# Altium project PCB_VIP_mobile_device.PrjPcb (part 1 of 2)
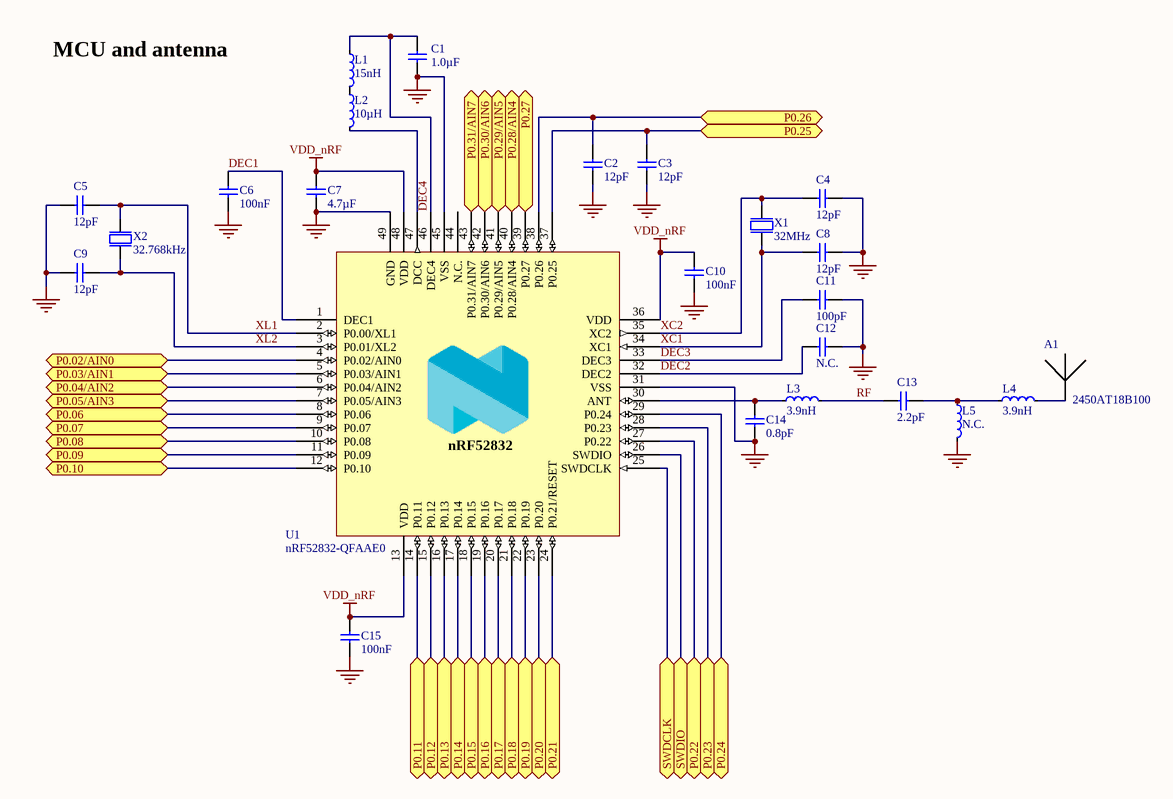
[diagram p0: Mobile_device_sheet2_mcu.SchDoc]
5 sheets, 103 parts. Net scope: flat (ports and power ports of the same name join across sheets).
Board file: Mobile_device.PcbDoc
Sheets:
  Mobile_device_sheet2_mcu.SchDoc
  Mobile_device_sheet3_pin_map.SchDoc
  Mobile_device_sheet4_sensor.SchDoc
  Mobile_device_sheet5_power_supply.SchDoc
  Mobile_device_sheet6_interfaces.SchDoc

## Sheet Mobile_device_sheet2_mcu.SchDoc
size A4; SheetNumber: 1; SheetTotal: 5

### Parts
A1  2450AT18B100  [2450AT18B100]
C1  1.0µF  [CAPC1608X06L]
C2  12pF  [CAPC1005X04L]
C3  12pF  [CAPC1005X04L]
C4  12pF  [CAPC1005X04L]
C5  12pF  [CAPC1005X04L]
C6  100nF  [CAPC1005X04L]
C7  4.7µF  [CAPC1608X06L]
C8  12pF  [CAPC1005X04L]
C9  12pF  [CAPC1005X04L]
C10  100nF  [CAPC1005X04L]
C11  100pF  [CAPC1005X04L]
C12  N.C.  [CAPC1005X04L]
C13  2.2pF  [CAPC1005X04L]
C14  0.8pF  [CAPC1005X04L]
C15  100nF  [CAPC1005X04L]
L1  15nH  [INDC1005X04L]
L2  10µH  [INDC1608X06L]
L3  3.9nH  [INDC1005X04L]
L4  3.9nH  [INDC1005X04L]
L5  N.C.  [INDC1005X04L]
U1  nRF52832-QFAAE0  [QFN40P600X600X90-48N]
X1  32MHz  [BT-XTAL_2016]
X2  32.768kHz  [XTAL_2012]

### Ports
P0.02/AIN0 (bidir), P0.03/AIN1 (bidir), P0.04/AIN2 (bidir), P0.05/AIN3 (bidir), P0.06 (bidir), P0.07 (bidir), P0.08 (bidir), P0.09 (bidir), P0.10 (bidir), P0.11 (bidir), P0.12 (bidir), P0.13 (bidir), P0.14 (bidir), P0.15 (bidir), P0.16 (bidir), P0.17 (bidir), P0.18 (bidir), P0.19 (bidir), P0.20 (bidir), P0.21 (bidir), P0.22 (bidir), P0.23 (bidir), P0.24 (bidir), P0.25 (bidir), P0.26 (bidir), P0.27 (bidir), P0.28/AIN4 (bidir), P0.29/AIN5 (bidir), P0.30/AIN6 (bidir), P0.31/AIN7 (bidir), SWDCLK (bidir), SWDIO (bidir)

### Nets
GND: C1.1 C2.1 C3.1 C4.2 C5.2 C6.2 C7.2 C8.2 C9.2 C10.2 C11.2 C12.1 C14.1 C15.2 L5.2 U1.31(VSS) U1.45(VSS) U1.49(GND) X1.2(GND) X1.4(GND)
VDD_nRF: C7.1 C10.1 C15.1 U1.13(VDD) U1.36(VDD) U1.48(VDD)
DEC1: C6.1 U1.1(DEC1)
DEC2: C12.2 U1.32(DEC2)
DEC3: C11.1 U1.33(DEC3)
DEC4: C1.2 L1.1 U1.46(DEC4)
P0.02: U1.4(P0.02/AIN0) ; port P0.02/AIN0
P0.03: U1.5(P0.03/AIN1) ; port P0.03/AIN1
P0.04: U1.6(P0.04/AIN2) ; port P0.04/AIN2
P0.05: U1.7(P0.05/AIN3) ; port P0.05/AIN3
P0.06: U1.8(P0.06) ; port P0.06
P0.07: U1.9(P0.07) ; port P0.07
P0.08: U1.10(P0.08) ; port P0.08
P0.09: U1.11(P0.09) ; port P0.09
P0.10: U1.12(P0.10) ; port P0.10
P0.11: U1.14(P0.11) ; port P0.11
P0.12: U1.15(P0.12) ; port P0.12
P0.13: U1.16(P0.13) ; port P0.13
P0.14: U1.17(P0.14) ; port P0.14
P0.15: U1.18(P0.15) ; port P0.15
P0.16: U1.19(P0.16) ; port P0.16
P0.17: U1.20(P0.17) ; port P0.17
P0.18: U1.21(P0.18) ; port P0.18
P0.19: U1.22(P0.19) ; port P0.19
P0.20: U1.23(P0.20) ; port P0.20
P0.21: U1.24(P0.21/RESET) ; port P0.21
P0.22: U1.27(P0.22) ; port P0.22
P0.23: U1.28(P0.23) ; port P0.23
P0.24: U1.29(P0.24) ; port P0.24
P0.25: C3.2 U1.37(P0.25) ; port P0.25
P0.26: C2.2 U1.38(P0.26) ; port P0.26
P0.27: U1.39(P0.27) ; port P0.27
P0.28: U1.40(P0.28/AIN4) ; port P0.28/AIN4
P0.29: U1.41(P0.29/AIN5) ; port P0.29/AIN5
P0.30: U1.42(P0.30/AIN6) ; port P0.30/AIN6
P0.31: U1.43(P0.31/AIN7) ; port P0.31/AIN7
RF: C13.2 L3.2
XC1: C8.1 U1.34(XC1) X1.1(inp)
XC2: C4.1 U1.35(XC2) X1.3(out)
XL1: C5.1 U1.2(P0.00/XL1) X2.1(inp)
XL2: C9.1 U1.3(P0.01/XL2) X2.2(out)
NetA1_1: A1.1 L4.2
NetC13_1: C13.1 L4.1 L5.1
NetC14_2: C14.2 L3.1 U1.30(ANT)
NetL1_2: L1.2 L2.1
NetL2_2: L2.2 U1.47(DCC)
NetP5_2: U1.26(SWDIO) ; port SWDIO
NetP5_4: U1.25(SWDCLK) ; port SWDCLK

Not connected (* = marked no-connect by the designer): U1 44(N.C.)

### Notes on the sheet
- MCU and antenna
- (in symbol nRF52832-QFAAE0) nRF52832

### Library data of the parts
A1 = Johanson 2450AT18B100: 2.45 GHz chip antenna; Manufacturer: Johanson Technology; Part number IPS: 00000007781; Artikkelnr Noca: N.A.; Part Number: Johanson 2450AT18B100; Manufacturer Part Number: 2450AT18B100; Footprint Doc: 2450AT18B100; LatestRevisionDate: 2013-09-13; Pin Count: 2; Publisher: Nordic Semiconductor; Published: 2013-09-13; Value: 2450AT18B100; Note: *; ComponentLink1URL: *; ComponentLink1Description: Datasheet; ComponentLink2URL: *; ComponentLink2Description: Supplier link; HelpURL: http://www.johansontechnology.com/datasheets/antennas/2450AT18B100.pdf; Supplier 1: Digi-Key; Supplier Part Number 1: 712-1006-1-ND; Supplier 2: *; Supplier Part Number 2: *
C1 = C0603-1µ0: Capacitor, X7R, ±10%; Part number IPS: 00000000616; Note: 16V; Artikkelnr Noca: 20039282; Part Number: C0603-1µ0; Manufacturer: *; Manufacturer Part Number: *; LatestRevisionDate: 2013-06-05; Pin Count: 2; Publisher: Nordic Semiconductor; Published: 2009-05-08; Value: 1.0µF; Footprint Doc: 0603; ComponentLink1URL: *; ComponentLink1Description: Datasheet; ComponentLink2URL: *; ComponentLink2Description: Supplier link; HelpURL: *; Supplier 1: *; Supplier Part Number 1: *; Supplier 2: *; Supplier Part Number 2: *
C2-C5 C8 C9 = C0402-12p: Capacitor, NP0, ±2%; Part number IPS: 00000002398; Note: 50V; Artikkelnr Noca: 20029159; Part Number: C0402-12p; Manufacturer: *; Manufacturer Part Number: *; LatestRevisionDate: 2011-05-11; Pin Count: 2; Publisher: Nordic Semiconductor; Published: 2009-05-08; Value: 12pF; Footprint Doc: 0402; ComponentLink1URL: *; ComponentLink1Description: Datasheet; ComponentLink2URL: *; ComponentLink2Description: Supplier link; HelpURL: *; Supplier 1: *; Supplier Part Number 1: *; Supplier 2: *; Supplier Part Number 2: *
C6 C10 C15 = C0402-100n: Capacitor, X7R, ±10%; Part number IPS: 00000005296; Note: 16V; Artikkelnr Noca: 20039200; Part Number: C0402-100n; Manufacturer: *; Manufacturer Part Number: *; LatestRevisionDate: 2009-11-23; Pin Count: 2; Publisher: Nordic Semiconductor; Published: 2009-05-08; Value: 100nF; Footprint Doc: 0402; ComponentLink1URL: *; ComponentLink1Description: Datasheet; ComponentLink2URL: *; ComponentLink2Description: Supplier link; HelpURL: *; Supplier 1: *; Supplier Part Number 1: *; Supplier 2: *; Supplier Part Number 2: *
C7 = C0603-4µ7: Capacitor, X5R, ±10%; Part number IPS: 00000007783; Note: 6.3V; Artikkelnr Noca: 20069060; Part Number: C0603-4µ7; Manufacturer: *; Manufacturer Part Number: *; LatestRevisionDate: 2009-11-23; Pin Count: 2; Publisher: Nordic Semiconductor; Published: 2009-05-08; Value: 4.7µF; Footprint Doc: 0603; ComponentLink1URL: *; ComponentLink1Description: Datasheet; ComponentLink2URL: *; ComponentLink2Description: Supplier link; HelpURL: *; Supplier 1: *; Supplier Part Number 1: *; Supplier 2: *; Supplier Part Number 2: *
C11 = C0402-100p: Capacitor, NP0, ±5%; Part number IPS: 00000002361; Note: 50V; Artikkelnr Noca: 20029135; Part Number: C0402-100p; Manufacturer: *; Manufacturer Part Number: *; LatestRevisionDate: 2009-05-08; Pin Count: 2; Publisher: Nordic Semiconductor; Published: 2009-05-08; Value: 100pF; Footprint Doc: 0402; ComponentLink1URL: *; ComponentLink1Description: Datasheet; ComponentLink2URL: *; ComponentLink2Description: Supplier link; HelpURL: *; Supplier 1: *; Supplier Part Number 1: *; Supplier 2: *; Supplier Part Number 2: *
C12 = C0402-N.C.: Not mounted; Note: Chip Cap; Artikkelnr Noca: N.A.; Assembly: Not mounted; Part Number: C0402-N.C.; Manufacturer: *; Manufacturer Part Number: *; LatestRevisionDate: 2009-05-08; Pin Count: 2; Publisher: Nordic Semiconductor; Published: 2009-05-08; Value: N.C.; Footprint Doc: 0402; Part number IPS: N.A.; ComponentLink1URL: *; ComponentLink1Description: Datasheet; ComponentLink2URL: *; ComponentLink2Description: Supplier link; HelpURL: *; Supplier 1: *; Supplier Part Number 1: *; Supplier 2: *; Supplier Part Number 2: *
C13 = C0402-2.2p: Capacitor, NP0, ±0.1pF; Part number IPS: 00000003105; Note: 50V; Artikkelnr Noca: 20029145; Part Number: C0402-2.2p; Manufacturer: *; Manufacturer Part Number: *; LatestRevisionDate: 2017-02-23; Pin Count: 2; Publisher: Nordic Semiconductor; Published: 2009-05-08; Value: 2.2pF; Footprint Doc: 0402; ComponentLink1URL: *; ComponentLink1Description: Datasheet; ComponentLink2URL: *; ComponentLink2Description: Supplier link; HelpURL: *; Supplier 1: Digi-Key; Supplier Part Number 1: 490-8092-1-ND; Supplier 2: *; Supplier Part Number 2: *
C14 = C0402-0.8p: Capacitor, NP0, ±5%; Part number IPS: 00000007782; Note: 50V; Artikkelnr Noca: 20029147; Part Number: C0402-0.8p; Manufacturer: *; Manufacturer Part Number: *; LatestRevisionDate: 2012-11-21; Pin Count: 2; Publisher: Nordic Semiconductor; Published: 2009-05-08; Value: 0.8pF; Footprint Doc: 0402; ComponentLink1URL: *; ComponentLink1Description: Datasheet; ComponentLink2URL: *; ComponentLink2Description: Supplier link; HelpURL: *; Supplier 1: *; Supplier Part Number 1: *; Supplier 2: *; Supplier Part Number 2: *
L1 = L0402-15n: Inductor, 320mA, ±5%; Manufacturer: Taiyo Yuden; Manufacturer Part Number: HK100515NJ-T; Part number IPS: 00000001262; Note: High frequency chip inductor ±10%; Artikkelnr Noca: 33029323; Part Number: L0402-15n; LatestRevisionDate: 2012-09-19; Pin Count: 2; Publisher: Nordic Semiconductor; Published: 2010-07-12; Value: 15nH; Footprint Doc: 0402; ComponentLink1Description: Datasheet; ComponentLink2Description: Supplier link; ComponentLink1URL: *; ComponentLink2URL: *; HelpURL: http://www.yuden.co.jp/productdata/catalog/en/mlci04_e.pdf; Supplier 1: Digi-Key; Supplier Part Number 1: 587-1521-1-ND; Supplier 2: Farnell; Supplier Part Number 2: 658-1328
L2 = L0603-10µ: Inductor, 80mA, ±10%; Manufacturer: Taiyo Yuden; Manufacturer Part Number: LBMF1608T100K; Part number IPS: 00000007794; Note: LBMF1608T100K 10µH 80mA 0603; Artikkelnr Noca: 33029314; Part Number: L0603-10µ; LatestRevisionDate: 2012-09-19; Pin Count: 2; Publisher: Nordic Semiconductor; Published: 2010-02-24; Value: 10µH; Footprint Doc: 0603; ComponentLink1Description: Datasheet; ComponentLink2Description: Supplier link; ComponentLink1URL: *; ComponentLink2URL: *; HelpURL: http://www.yuden.co.jp/ut/product/pdf/elb2_e.pdf; Supplier 1: Digi-Key; Supplier Part Number 1: 587-1714-1-ND; Supplier 2: Farnell; Supplier Part Number 2: 178-6105
L3 L4 = L0402-3n9: Inductor, 170mA, ±0.1nH; Manufacturer: Murata; Manufacturer Part Number: LQP15MN3N9B02D; Part number IPS: 00000007793; Note: High frequency chip inductor ±5%; Artikkelnr Noca: 33029151; Part Number: L0402-3n9; LatestRevisionDate: 2012-09-19; Pin Count: 2; Publisher: Nordic Semiconductor; Published: 2009-05-08; Value: 3.9nH; Footprint Doc: 0402; ComponentLink1Description: Datasheet; ComponentLink2Description: Supplier link; ComponentLink1URL: *; ComponentLink2URL: *; HelpURL: http://search.murata.co.jp/Ceramy/image/img/PDF/ENG/L0075S0084LQP15M.pdf; Supplier 1: Digi-Key; Supplier Part Number 1: 490-1131-1-ND; Supplier 2: *; Supplier Part Number 2: *
L5 = L0402-N.C.: Not mounted; Artikkelnr Noca: N.A.; Assembly: Not mounted; Part Number: L0402-N.C.; Manufacturer: *; Manufacturer Part Number: *; LatestRevisionDate: 2016-11-24; Pin Count: 2; Publisher: Nordic Semiconductor; Published: 2016-11-24; Value: N.C.; Note: *; Footprint Doc: 0402; Part number IPS: N.A.; ComponentLink1Description: Datasheet; ComponentLink2Description: Supplier link; ComponentLink1URL: *; ComponentLink2URL: *; HelpURL: *; Supplier 1: *; Supplier Part Number 1: *; Supplier 2: *; Supplier Part Number 2: *
U1 = nRF52832-QFAAE0: Multi-protocol Bluetooth Low Energy, ANT and 2.4GHz proprietary system-on-chip; Manufacturer: Nordic Semiconductor; Artikkelnr Noca: N.A.; Part Number: nRF52832-QFAAE0; Manufacturer Part Number: nRF52832-QFAAE0; LatestRevisionDate: 2017-10-18; Pin Count: 48; Publisher: Nordic Semiconductor; Published: 2017-10-18; Value: nRF52832-QFAAE0; Note: *; Footprint Doc: QFN-48; Part number IPS: N.A.; ComponentLink1URL: *; ComponentLink1Description: Datasheet; ComponentLink2URL: *; ComponentLink2Description: Supplier link; HelpURL: *; Supplier 1: Nordic Semiconductor; Supplier Part Number 1: nRF52832-QFAAE0; Supplier 2: *; Supplier Part Number 2: *
X1 = XTAL_SMD2016_32MHz_8pF_Kyocera: XTAL SMD 2016, 32MHz, Cl=8pF, Tot: ±40ppm; Manufacturer Part Number: CX2016DB32000D0WZRC1; Part number IPS: 00000007827; Note: XTAL SMD 32.000MHz; Artikkelnr Noca: 22010022; Part Number: XTAL_SMD2016_32MHz_8pF_Kyocera; Manufacturer: Kyocera; LatestRevisionDate: 2016-06-02; Pin Count: 4; Publisher: Nordic Semiconductor; Published: 2015-10-15; Value: 32MHz; Footprint Doc: XTAL_2016; ComponentLink1URL: *; ComponentLink1Description: Datasheet; ComponentLink2URL: *; ComponentLink2Description: Supplier link; HelpURL: http://media.digikey.com/pdf/Data%20Sheets/AVX%20PDFs/CX2016DB32000D0WZRC1_Spec.pdf; Supplier 1: Digi-Key; Supplier Part Number 1: 1253-1586-1-ND; Supplier 2: *; Supplier Part Number 2: *
X2 = XTAL_SMD2012_32.768kHz_9pF_MC: XTAL SMD 2012, 32.768kHz, 9pF, ±20ppm; Manufacturer: Micro Crystal; Manufacturer Part Number: CM8V-T1A 32.768KHZ 9PF +/-20PPM TA QC; Part number IPS: 00000007828; Note: XTAL SMD 32.768kHz; Artikkelnr Noca: N.A.; Part Number: XTAL_SMD2012_32.768kHz_9pF_MC; LatestRevisionDate: 2017-01-30; Pin Count: 2; Publisher: Nordic Semiconductor; Published: 2016-09-15; Value: 32.768kHz; Footprint Doc: XTAL_2012; ComponentLink1URL: *; ComponentLink1Description: Datasheet; ComponentLink2URL: *; ComponentLink2Description: Supplier link; HelpURL: http://www.microcrystal.com/images/_PDF/3_Crystal_Ceramic-Package/cm8v-t1a.pdf; Supplier 1: Allied; Supplier Part Number 1: 70417961; Supplier 2: *; Supplier Part Number 2: *

## Sheet Mobile_device_sheet3_pin_map.SchDoc
size A4; SheetNumber: 2; SheetTotal: 5
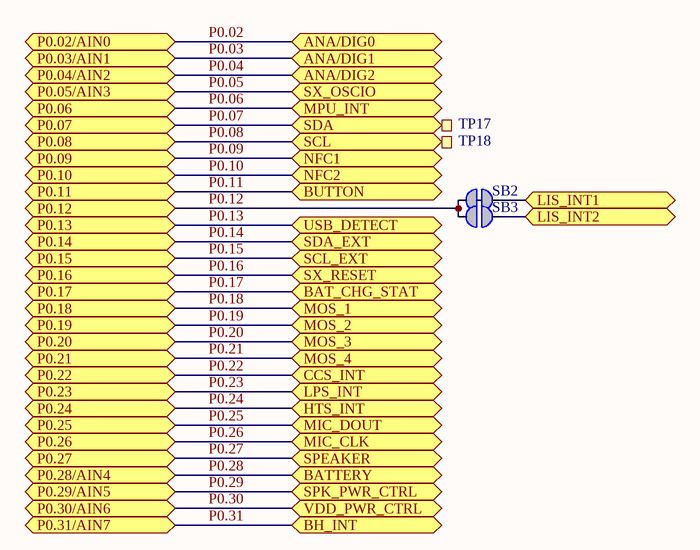
[diagram p1: Mobile_device_sheet3_pin_map.SchDoc]

### Parts
SB2  Solderbridge  [Solderbridge_Shorted]  (value not drawn)  (net tie, no BOM)
SB3  Solderbridge  [Solderbridge]  (value not drawn)  (no BOM)
TP17  Ø1.5mm,SMD  [TP_SMD_Ø1.5mm]  (value not drawn)  (no BOM)
TP18  Ø1.5mm,SMD  [TP_SMD_Ø1.5mm]  (value not drawn)  (no BOM)

### Ports
ANA/DIG0 (bidir), ANA/DIG1 (bidir), ANA/DIG2 (bidir), BAT_CHG_STAT (bidir), BATTERY (bidir), BH_INT (bidir), BUTTON (bidir), CCS_INT (bidir), HTS_INT (bidir), LIS_INT1 (bidir), LIS_INT2 (bidir), LPS_INT (bidir), MIC_CLK (bidir), MIC_DOUT (bidir), MOS_1 (bidir), MOS_2 (bidir), MOS_3 (bidir), MOS_4 (bidir), MPU_INT (bidir), NFC1 (bidir), NFC2 (bidir), P0.02/AIN0 (bidir), P0.03/AIN1 (bidir), P0.04/AIN2 (bidir), P0.05/AIN3 (bidir), P0.06 (bidir), P0.07 (bidir), P0.08 (bidir), P0.09 (bidir), P0.10 (bidir), P0.11 (bidir), P0.12 (bidir), P0.13 (bidir), P0.14 (bidir), P0.15 (bidir), P0.16 (bidir), P0.17 (bidir), P0.18 (bidir), P0.19 (bidir), P0.20 (bidir), P0.21 (bidir), P0.22 (bidir), P0.23 (bidir), P0.24 (bidir), P0.25 (bidir), P0.26 (bidir), P0.27 (bidir), P0.28/AIN4 (bidir), P0.29/AIN5 (bidir), P0.30/AIN6 (bidir), P0.31/AIN7 (bidir), SCL (bidir), SCL_EXT (bidir), SDA (bidir), SDA_EXT (bidir), SPEAKER (bidir), SPK_PWR_CTRL (bidir), SX_OSCIO (bidir), SX_RESET (bidir), USB_DETECT (bidir), VDD_PWR_CTRL (bidir)

### Nets
P0.02: port P0.02/AIN0, port ANA/DIG0
P0.03: port P0.03/AIN1, port ANA/DIG1
P0.04: port P0.04/AIN2, port ANA/DIG2
P0.05: port P0.05/AIN3, port SX_OSCIO
P0.06: port MPU_INT, port P0.06
P0.07: TP17.1 ; port SDA, port P0.07
P0.08: TP18.1 ; port SCL, port P0.08
P0.09: port NFC1, port P0.09
P0.10: port NFC2, port P0.10
P0.11: port P0.11, port BUTTON
P0.12: SB2.2 SB3.2 ; port P0.12
P0.13: port P0.13, port USB_DETECT
P0.14: port P0.14, port SDA_EXT
P0.15: port P0.15, port SCL_EXT
P0.16: port P0.16, port SX_RESET
P0.17: port P0.17, port BAT_CHG_STAT
P0.18: port MOS_1, port P0.18
P0.19: port MOS_2, port P0.19
P0.20: port MOS_3, port P0.20
P0.21: port MOS_4, port P0.21
P0.22: port P0.22, port CCS_INT
P0.23: port LPS_INT, port P0.23
P0.24: port P0.24, port HTS_INT
P0.25: port MIC_DOUT, port P0.25
P0.26: port MIC_CLK, port P0.26
P0.27: port SPEAKER, port P0.27
P0.28: port BATTERY, port P0.28/AIN4
P0.29: port P0.29/AIN5, port SPK_PWR_CTRL
P0.30: port P0.30/AIN6, port VDD_PWR_CTRL
P0.31: port P0.31/AIN7, port BH_INT
NetSB2_1: SB2.1 ; port LIS_INT1
NetSB3_1: SB3.1 ; port LIS_INT2

### Library data of the parts
SB2 = Solderbridge Shorted: Shorted Solderbridge; Artikkelnr Noca: N.A.; Part Number: Solderbridge Shorted; Manufacturer: *; Manufacturer Part Number: *; Footprint Doc: Solderbridge_Shorted; LatestRevisionDate: 2012-08-07; Pin Count: 2; Publisher: Nordic Semiconductor; Published: 2012-08-07; Value: Solderbridge; Note: *; Part number IPS: N.A.; ComponentLink1URL: *; ComponentLink1Description: Datasheet; ComponentLink2URL: *; ComponentLink2Description: Supplier link; HelpURL: *; Supplier 1: *; Supplier Part Number 1: *; Supplier 2: *; Supplier Part Number 2: *
SB3 = Solderbridge: Artikkelnr Noca: N.A.; Part Number: Solderbridge; Manufacturer: *; Manufacturer Part Number: *; Footprint Doc: Solderbridge; LatestRevisionDate: 2009-12-14; Pin Count: 2; Publisher: Nordic Semiconductor; Published: 2009-12-14; Value: Solderbridge; Note: *; Part number IPS: N.A.; ComponentLink1URL: *; ComponentLink1Description: Datasheet; ComponentLink2URL: *; ComponentLink2Description: Supplier link; HelpURL: *; Supplier 1: *; Supplier Part Number 1: *; Supplier 2: *; Supplier Part Number 2: *
TP17 TP18 = TP_SMD_Ø1.5MM: 1.0mm circular SMD testpad; Manufacturer: Nordic Semiconductor; Artikkelnr Noca: N.A.; Part Number: TP_SMD_Ø1.5MM; Manufacturer Part Number: *; Footprint Doc: TP_SMD_Ø1.5mm; LatestRevisionDate: 2016-06-02; Pin Count: 1; Publisher: Nordic Semiconductor; Published: 2016-06-02; Value: Ø1.5mm,SMD; Note: *; Part number IPS: N.A.; ComponentLink1URL: *; ComponentLink1Description: Datasheet; ComponentLink2URL: *; ComponentLink2Description: Supplier link; HelpURL: *; Supplier 1: *; Supplier Part Number 1: *; Supplier 2: *; Supplier Part Number 2: *

## Sheet Mobile_device_sheet4_sensor.SchDoc
size A4; SheetNumber: 3; SheetTotal: 5
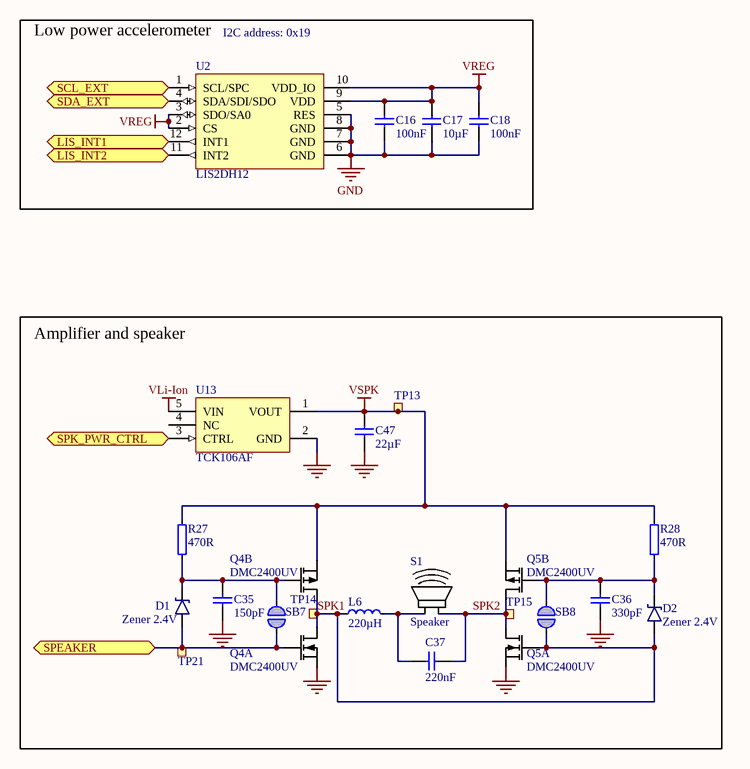
[diagram p2: Mobile_device_sheet4_sensor.SchDoc]

### Parts
C16  100nF  [CAPC1005X04L]
C17  10µF  [CAPC1608X06L]
C18  100nF  [CAPC1005X04L]
C35  150pF  [CAPC1005X04L]
C36  330pF  [CAPC1005X04L]
C37  220nF  [CAPC1005X04L]
C47  22µF  [CAPC1608X06L]
D1  Zener 2.4V  [SOD-523]
D2  Zener 2.4V  [SOD-523]
L6  220µH  [INDP4040X25N]
Q4  DMC2400UV  [SOTFL50P162X60-6N]  (parts A,B of 2)
Q5  DMC2400UV  [SOTFL50P162X60-6N]  (parts A,B of 2)
R27  470R  [RESC1005X04L]
R28  470R  [RESC1005X04L]
S1  Speaker  [Speaker 15x11x3mm]  (no BOM)
SB7  Solderbridge  [Solderbridge]  (value not drawn)  (no BOM)
SB8  Solderbridge  [Solderbridge]  (value not drawn)  (no BOM)
TP13  Ø1.5mm,SMD  [TP_SMD_Ø1.5mm]  (value not drawn)  (no BOM)
TP14  Ø1.5mm,SMD  [TP_SMD_Ø1.5mm]  (value not drawn)  (no BOM)
TP15  Ø1.5mm,SMD  [TP_SMD_Ø1.5mm]  (value not drawn)  (no BOM)
TP21  Ø1.5mm,SMD  [TP_SMD_Ø1.5mm]  (value not drawn)  (no BOM)
U2  LIS2DH12  [LGA50P200X200X100-12N]
U13  TCK106AF  [SOT95P280X140-5N]

### Blocks framed on the sheet
Low power accelerometer: C16-C18 U2
Amplifier and speaker: C35-C37 C47 D1 D2 L6 Q4 Q5 R27 R28 S1 SB7 SB8 TP13-TP15 TP21 U13

### Ports
LIS_INT1 (bidir), LIS_INT2 (bidir), SCL_EXT (bidir), SDA_EXT (bidir), SPEAKER (bidir), SPK_PWR_CTRL (bidir)

### Nets
GND: C16.1 C17.1 C18.1 C35.1 C36.1 C47.1 Q4.1(S1) Q5.1(S1) U2.5(RES) U2.6(GND) U2.7(GND) U2.8(GND) U13.2(GND)
VLi-Ion: U13.5(VIN)
VREG: C16.2 C17.2 C18.2 U2.2(CS) U2.3(SDO/SA0) U2.9(VDD) U2.10(VDD_IO)
VSPK: C47.2 Q4.4(S2) Q5.4(S2) R27.1 R28.1 TP13.1 U13.1(VOUT)
P0.14: U2.4(SDA/SDI/SDO) ; port SDA_EXT
P0.15: U2.1(SCL/SPC) ; port SCL_EXT
P0.27: D1.1(A) Q4.2(G1) SB7.2 TP21.1 ; port SPEAKER
P0.29: U13.3(CTRL) ; port SPK_PWR_CTRL
SPK1: D2.1(A) L6.1 Q4.3(D2) Q4.6(D1) Q5.2(G1) SB8.2 TP14.1
SPK2: C37.1 Q5.3(D2) Q5.6(D1) S1.2 TP15.1
NetC35_2: C35.2 D1.3(C) Q4.5(G2) R27.2 SB7.1
NetC36_2: C36.2 D2.3(C) Q5.5(G2) R28.2 SB8.1
NetC37_2: C37.2 L6.2 S1.1
NetSB2_1: U2.12(INT1) ; port LIS_INT1
NetSB3_1: U2.11(INT2) ; port LIS_INT2

Not connected (* = marked no-connect by the designer): U13 4(NC)

### Notes on the sheet
- (near U2) I2C address: 0x19

### Library data of the parts
C16 C18 = C0402-100n: as C6 on sheet Mobile_device_sheet2_mcu; Part Number: C0402-100n; Manufacturer: *; Manufacturer Part Number: *; Footprint Doc: 0402; LatestRevisionDate: 2009-11-23; Pin Count: 2; Publisher: Nordic Semiconductor; Published: 2009-05-08; Value: 100nF; ComponentLink1URL: *; ComponentLink1Description: Datasheet; ComponentLink2URL: *; ComponentLink2Description: Supplier link; HelpURL: *; Supplier 1: *; Supplier Part Number 1: *; Supplier 2: *; Supplier Part Number 2: *
C17 = C0603-10µ: Capacitor, X5R, ±20%; Part number IPS: 00000007785; Note: 6.3V; Artikkelnr Noca: 20039234; Part Number: C0603-10µ; Manufacturer: *; Manufacturer Part Number: *; Footprint Doc: 0603; LatestRevisionDate: 2011-01-17; Pin Count: 2; Publisher: Nordic Semiconductor; Published: 2011-01-17; Value: 10µF; ComponentLink1URL: *; ComponentLink1Description: Datasheet; ComponentLink2URL: *; ComponentLink2Description: Supplier link; HelpURL: *; Supplier 1: *; Supplier Part Number 1: *; Supplier 2: *; Supplier Part Number 2: *
C35 = C0402-150p: Capacitor, NP0, ±5%; Part number IPS: 00000007972; Note: 50V; Artikkelnr Noca: 20029111; Part Number: C0402-150p; Manufacturer: *; Manufacturer Part Number: *; Footprint Doc: 0402; LatestRevisionDate: 2009-05-08; Pin Count: 2; Publisher: Nordic Semiconductor; Published: 2009-05-08; Value: 150pF; ComponentLink1URL: *; ComponentLink1Description: Datasheet; ComponentLink2URL: *; ComponentLink2Description: Supplier link; HelpURL: *; Supplier 1: *; Supplier Part Number 1: *; Supplier 2: *; Supplier Part Number 2: *
C36 = C0402-330p: Capacitor, NP0, ±5%; Part number IPS: 00000006576; Note: 50V; Artikkelnr Noca: N.A.; Part Number: C0402-330p; Manufacturer: *; Manufacturer Part Number: *; Footprint Doc: 0402; LatestRevisionDate: 2017-02-02; Pin Count: 2; Publisher: Nordic Semiconductor; Published: 2009-05-08; Value: 330pF; ComponentLink1URL: *; ComponentLink1Description: Datasheet; ComponentLink2URL: *; ComponentLink2Description: Supplier link; HelpURL: *; Supplier 1: *; Supplier Part Number 1: *; Supplier 2: *; Supplier Part Number 2: *
C37 = C0402-220n: Capacitor, X7R, ±10%; Part number IPS: 00000006793; Note: 16V; Artikkelnr Noca: N.A.; Part Number: C0402-220n; Manufacturer: *; Manufacturer Part Number: *; Footprint Doc: 0402; LatestRevisionDate: 2009-05-08; Pin Count: 2; Publisher: Nordic Semiconductor; Published: 2009-05-08; Value: 220nF; ComponentLink1URL: *; ComponentLink1Description: Datasheet; ComponentLink2URL: *; ComponentLink2Description: Supplier link; HelpURL: *; Supplier 1: *; Supplier Part Number 1: *; Supplier 2: *; Supplier Part Number 2: *
C47 = C0603-22µ-6.3V: CAP CER 22UF 6.3V 20% X5R 0603; Manufacturer: Samsung; Manufacturer Part Number: CL10A226MQ8NRNC; Part number IPS: 00000007787; Artikkelnr Noca: N.A.; Part Number: C0603-22µ-6.3V; Footprint Doc: 0603; LatestRevisionDate: 2015-04-10; Pin Count: 2; Publisher: Nordic Semiconductor; Published: 2015-04-10; Value: 22µF; Note: 6.3V; ComponentLink1URL: *; ComponentLink1Description: Datasheet; ComponentLink2URL: *; ComponentLink2Description: Supplier link; HelpURL: http://www.samsungsem.com/kr/front/downloadcms.do?path=/kr/support/product-search/mlcc/__icsFiles/afieldfile/2014/11/05&fileName=S_CL10A226MQ8NRNC.pdf; Supplier 1: Digi-Key; Supplier Part Number 1: 1276-1193-1-ND; Supplier 2: *; Supplier Part Number 2: *
D1 D2 = BZT52C2V4T: Diode, Zener, 2.4V, 0.3W; Manufacturer: Diodes Incorporated; Part number IPS: 00000007974; Artikkelnr Noca: N.A.; Part Number: BZT52C2V4T; Manufacturer Part Number: BZT52C2V4T; Footprint Doc: SOD-523; LatestRevisionDate: 2017-01-25; Publisher: Nordic Semiconductor; Published: 2017-01-25; Value: Zener 2.4V; Note: *; Pin Count: 2; ComponentLink1URL: *; ComponentLink1Description: Datasheet; ComponentLink2URL: *; ComponentLink2Description: Supplier link; HelpURL: http://www.diodes.com/_files/datasheets/ds30502.pdf; Supplier 1: Digi-Key; Supplier Part Number 1: BZT52C2V4T-7DICT-ND; Supplier 2: *; Supplier Part Number 2: *
L6 = L4040-220µ: Inductor, ±20%, 200mA, 2.76 Ohm; Manufacturer: Bourns; Manufacturer Part Number: SRN4026-221M; Part number IPS: 00000007797; Note: -40°C ~ 125°C; Artikkelnr Noca: N:A; Part Number: L4040-220µ; Footprint Doc: 4040; LatestRevisionDate: 2016-01-18; Pin Count: 2; Publisher: Nordic Semiconductor; Published: 2016-01-18; Value: 220µH; ComponentLink1Description: Datasheet; ComponentLink2Description: Supplier link; ComponentLink1URL: *; ComponentLink2URL: *; HelpURL: http://www.bourns.com/docs/Product-Datasheets/SRN4026.pdf; Supplier 1: Digi-Key; Supplier Part Number 1: SRN4026-221MCT-ND; Supplier 2: *; Supplier Part Number 2: *
Q4 Q5 = DMC2400UV: Dual N & P Ch MOFET, 1.03A/0.7A, 480mOhm, 450mW; Manufacturer: Diodes Incorporated; Part number IPS: 00000007803; Note: Dual N & P Channel Digital FET; Artikkelnr Noca: N.A.; Part Number: DMC2400UV; Manufacturer Part Number: DMC2400UV; Footprint Doc: SOT-563; LatestRevisionDate: 2016-01-18; Pin Count: 6; Publisher: Nordic Semiconductor; Published: 2016-01-18; Value: DMC2400UV; ComponentLink1URL: *; ComponentLink1Description: Datasheet; ComponentLink2URL: *; ComponentLink2Description: Supplier link; HelpURL: http://www.diodes.com/_files/datasheets/DMC2400UV.pdf; Supplier 1: Digi-Key; Supplier Part Number 1: DMC2400UV-7DICT-ND; Supplier 2: *; Supplier Part Number 2: *
R27 R28 = R0402-470: Resistor, ±1%, 0.063W; Part number IPS: 00000007975; Note: Chip Res 1%; Artikkelnr Noca: 27049065; Part Number: R0402-470; Manufacturer: *; Manufacturer Part Number: *; LatestRevisionDate: 2009-11-23; Pin Count: 2; Publisher: Nordic Semiconductor; Published: 2009-05-08; Value: 470R; Footprint Doc: 0402; ComponentLink1URL: *; ComponentLink1Description: Datasheet; ComponentLink2URL: *; ComponentLink2Description: Supplier link; HelpURL: *; Supplier 1: Farnell; Supplier Part Number 1: 173-8845; Supplier 2: *; Supplier Part Number 2: *
S1 = BMS1511F-11C-08H03P LF: Speaker, SMD, 15.0mm x 11.0mm x 3.0mm, 0Hz-20kHz, 89dB, 8 ohm, 0.7W; Manufacturer: BeStar; Artikkelnr Noca: N.A.; Part Number: BMS1511F-11C-08H03P LF; Manufacturer Part Number: BMS1511F-11C-08H03P LF; Footprint Doc: Speaker 15x11x3mm; LatestRevisionDate: 2016-09-15; Pin Count: 2; Publisher: Nordic Semiconductor; Published: 2016-09-15; Value: Speaker; Note: *; Part number IPS: N.A.; ComponentLink1URL: *; ComponentLink1Description: Datasheet; ComponentLink2URL: *; ComponentLink2Description: Supplier link; HelpURL: \\hizz\pro\app9717\Datasheet\speakers\bestar\BMS1511F-11C-08H03P LF.pdf; Supplier 1: *; Supplier Part Number 1: *; Supplier 2: *; Supplier Part Number 2: *
SB7 SB8 = Solderbridge: Artikkelnr Noca: N.A.; Part Number: Solderbridge; Manufacturer: *; Manufacturer Part Number: *; Footprint Doc: Solderbridge; LatestRevisionDate: 2009-12-14; Pin Count: 2; Publisher: Nordic Semiconductor; Published: 2009-12-14; Value: Solderbridge; Note: *; Part number IPS: N.A.; ComponentLink1URL: *; ComponentLink1Description: Datasheet; ComponentLink2URL: *; ComponentLink2Description: Supplier link; HelpURL: *; Supplier 1: *; Supplier Part Number 1: *; Supplier 2: *; Supplier Part Number 2: *
TP13-TP15 TP21 = TP_SMD_Ø1.5MM: as TP17 on sheet Mobile_device_sheet3_pin_map; Part Number: TP_SMD_Ø1.5MM; Manufacturer Part Number: *; Footprint Doc: TP_SMD_Ø1.5mm; LatestRevisionDate: 2016-06-02; Pin Count: 1; Publisher: Nordic Semiconductor; Published: 2016-06-02; Value: Ø1.5mm,SMD; Note: *; Part number IPS: N.A.; ComponentLink1URL: *; ComponentLink1Description: Datasheet; ComponentLink2URL: *; ComponentLink2Description: Supplier link; HelpURL: *; Supplier 1: *; Supplier Part Number 1: *; Supplier 2: *; Supplier Part Number 2: *
U2 = LIS2DH12: 3-axis - ±2g/±4g/±8g/±16g digital output femto accelerometer; Manufacturer: STMicroelectronics; Part number IPS: 00000007817; Note: MEMS digital output motion sensor ultra low-power high performance 3-axes "femto" accelerometer; Artikkelnr Noca: N.A.; Part Number: LIS2DH12; Manufacturer Part Number: LIS2DH12; Footprint Doc: LGA-12; LatestRevisionDate: 2015-09-29; Pin Count: 12; Publisher: Nordic Semiconductor; Published: 2015-09-29; Value: LIS2DH12; ComponentLink1URL: *; ComponentLink1Description: Datasheet; ComponentLink2URL: *; ComponentLink2Description: Supplier link; HelpURL: http://www.st.com/st-web-ui/static/active/en/resource/technical/document/datasheet/DM00091513.pdf; Supplier 1: Digi-Key; Supplier Part Number 1: 497-14851-1-ND; Supplier 2: Farnell; Supplier Part Number 2: 243-3081
U13 = TCK106AF,LF: 1.0 A Load Switch IC with Slew Rate Control Driver in Small Package; Manufacturer: Toshiba; Part number IPS: 00000007823; Artikkelnr Noca: 15070086; Part Number: TCK106AF,LF; Manufacturer Part Number: TCK106AF,LF; Footprint Doc: SOT-25; LatestRevisionDate: 2016-09-29; Pin Count: 5; Publisher: Nordic Semiconductor; Published: 2016-09-29; Value: TCK106AF; Note: *; Supplier 1: Digi-Key; Supplier Part Number 1: TCK106AFLFCT-ND; Supplier 2: *; Supplier Part Number 2: *; ComponentLink1URL: *; ComponentLink1Description: Datasheet; ComponentLink2URL: *; ComponentLink2Description: Supplier link; HelpURL: https://toshiba.semicon-storage.com/info/docget.jsp?did=53240&prodName=TCK108AF

## Sheet Mobile_device_sheet5_power_supply.SchDoc
size A4; SheetNumber: 4; SheetTotal: 5
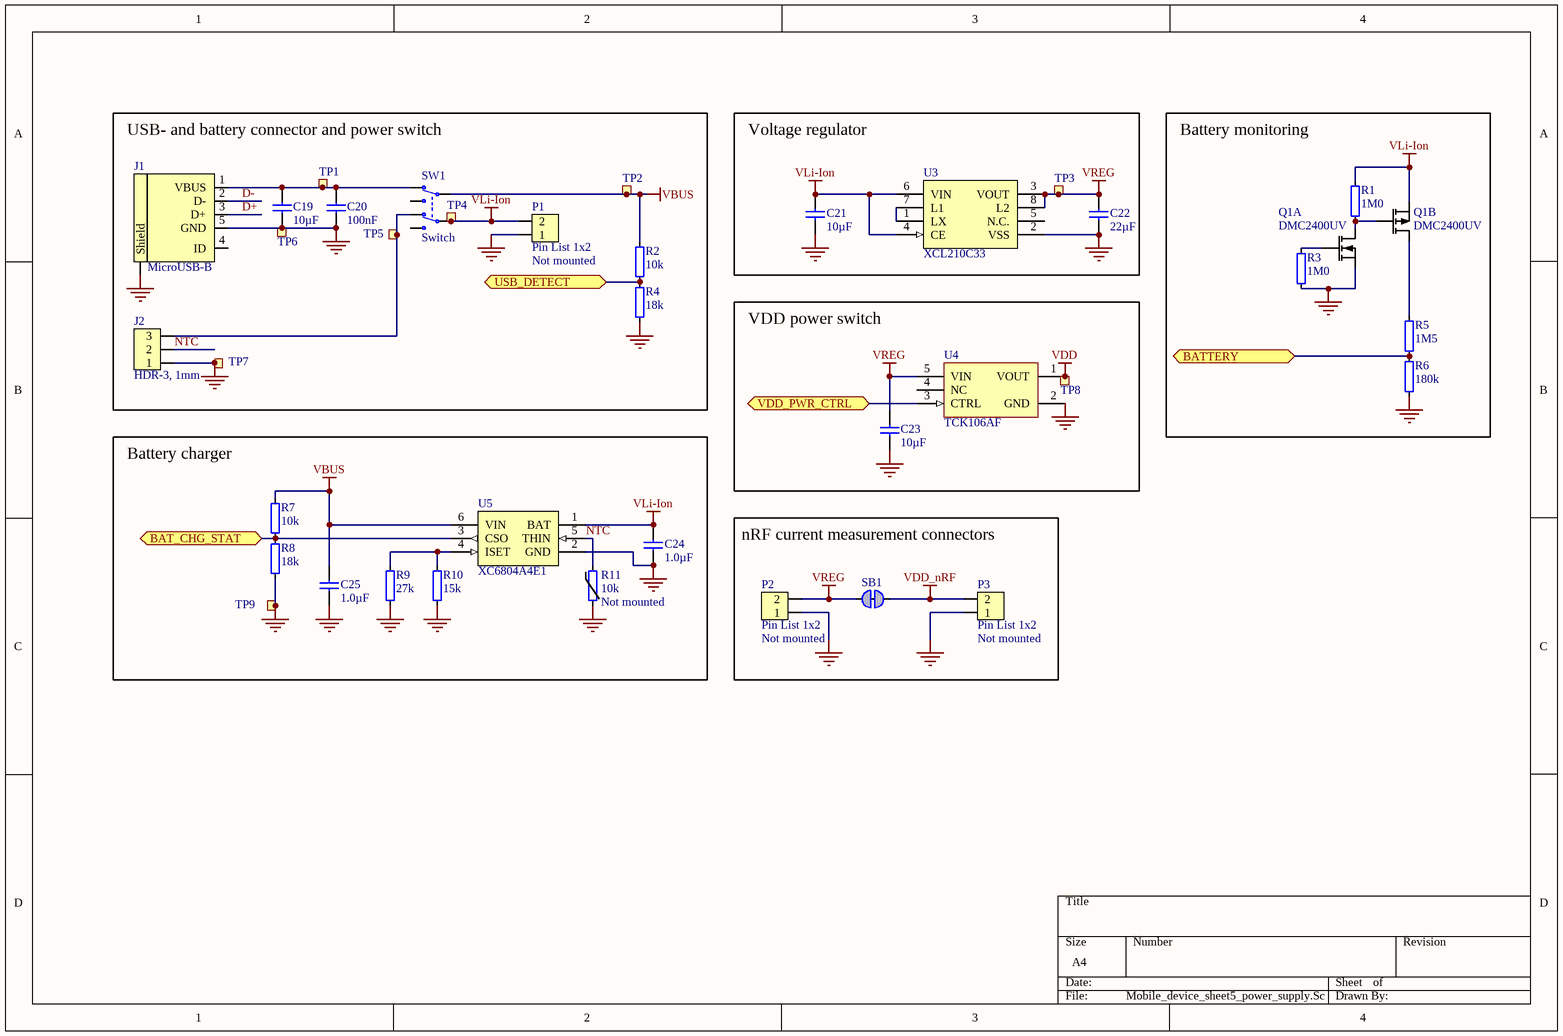
[diagram p3: Mobile_device_sheet5_power_supply.SchDoc]

### Parts
C19  10µF  [CAPC1608X06L]
C20  100nF  [CAPC1005X04L]
C21  10µF  [CAPC1608X06L]
C22  22µF  [CAPC1608X06L]
C23  10µF  [CAPC1608X06L]
C24  1.0µF  [CAPC1608X06L]
C25  1.0µF  [CAPC1608X06L]
J1  MicroUSB-B  [USB-Micro-B-RA-SMD-PiP]
J2  HDR-3, 1mm  [SM03B-SRSS-TB]
P1  Pin List 1x2  Assembly: Not mounted  [LIST_1x2-NC]
P2  Pin List 1x2  Assembly: Not mounted  [LIST_1x2-NC]
P3  Pin List 1x2  Assembly: Not mounted  [LIST_1x2-NC]
Q1  DMC2400UV  [SOTFL50P162X60-6N]  (parts A,B of 2)
R1  1M0  [RESC1005X04L]
R2  10k  [RESC1005X04L]
R3  1M0  [RESC1005X04L]
R4  18k  [RESC1005X04L]
R5  1M5  [RESC1005X04L]
R6  180k  [RESC1005X04L]
R7  10k  [RESC1005X04L]
R8  18k  [RESC1005X04L]
R9  27k  [RESC1005X04L]
R10  15k  [RESC1005X04L]
R11  10k  Assembly: Not mounted  [RESC1005X04L]
SB1  Solderbridge  [Solderbridge_Shorted]  (value not drawn)  (net tie, no BOM)
SW1  Switch  [Switch-Slide-RA-J-Lead-DPDT-8.5x3.5mm]
TP1  Ø1.5mm,SMD  [TP_SMD_Ø1.5mm]  (value not drawn)  (no BOM)
TP2  Ø1.5mm,SMD  [TP_SMD_Ø1.5mm]  (value not drawn)  (no BOM)
TP3  Ø1.5mm,SMD  [TP_SMD_Ø1.5mm]  (value not drawn)  (no BOM)
TP4  Ø1.5mm,SMD  [TP_SMD_Ø1.5mm]  (value not drawn)  (no BOM)
TP5  Ø1.5mm,SMD  [TP_SMD_Ø1.5mm]  (value not drawn)  (no BOM)
TP6  Ø1.5mm,SMD  [TP_SMD_Ø1.5mm]  (value not drawn)  (no BOM)
TP7  Ø1.5mm,SMD  [TP_SMD_Ø1.5mm]  (value not drawn)  (no BOM)
TP8  Ø1.5mm,SMD  [TP_SMD_Ø1.5mm]  (value not drawn)  (no BOM)
TP9  TP  [TESTPAD-TH]  (value not drawn)  (no BOM)
U3  XCL210C33  [CL-2025]
U4  TCK106AF  [SOT95P280X140-5N]
U5  XC6804A4E1  [USP-6EL]

### Blocks framed on the sheet
USB- and battery connector and power switch: C19 C20 J1 J2 P1 R2 R4 SW1 TP1 TP2 TP4-TP7
Voltage regulator: C21 C22 TP3 U3
Battery monitoring: Q1 R1 R3 R5 R6
VDD power switch: C23 TP8 U4
Battery charger: C24 C25 R7-R11 TP9 U5
nRF current measurement connectors: P2 P3 SB1

### Ports
BAT_CHG_STAT (bidir), BATTERY (bidir), USB_DETECT (bidir), VDD_PWR_CTRL (bidir)

### Nets
GND: C19.2 C20.2 C21.1 C22.1 C23.1 C24.1 C25.1 J1.5(GND) J1.6(Shield) J2.1 P1.1 P2.1 P3.1 Q1.1(S1) R3.2 R4.2 R6.2 R8.2 R9.2 R10.2 R11.2 TP6.1 TP7.1 TP9.1 U3.2(VSS) U3.9(VSS) U4.2(GND) U5.2(GND) U5.7(GND)
VBUS: C25.2 R2.1 R7.1 SW1.2(COM-1) TP2.1 U5.6(VIN)
VDD: TP8.1 U4.1(VOUT)
VDD_nRF: P3.2 SB1.1
VLi-Ion: C21.2 C24.2 P1.2 Q1.4(S2) R1.1 SW1.5(COM-2) TP4.1 U3.4(CE) U3.6(VIN) U5.1(BAT)
VREG: C22.2 C23.2 P2.2 SB1.2 TP3.1 U3.3(VOUT) U3.8(L2) U4.5(VIN)
D+: J1.3(D+)
D-: J1.2(D-)
NTC: J2.2 R11.1 U5.5(THIN)
P0.13: R2.2 R4.1 ; port USB_DETECT
P0.17: R7.2 R8.1 U5.3(CSO) ; port BAT_CHG_STAT
P0.28: R5.2 R6.1 ; port BATTERY
P0.30: U4.3(CTRL) ; port VDD_PWR_CTRL
NetC19_1: C19.1 C20.1 J1.1(VBUS) SW1.3(N.C-1) TP1.1
NetJ2_3: J2.3 SW1.6(N.C-2) TP5.1
NetQ1_2: Q1.2(G1) R3.1
NetQ1_3: Q1.3(D2) R5.1
NetQ1_5: Q1.5(G2) Q1.6(D1) R1.2
NetR9_1: R9.1 R10.1 U5.4(ISET)
NetU3_1: U3.1(LX) U3.7(L1)

Not connected (* = marked no-connect by the designer): J1 4(ID); SW1 1(N.O-1) 4(N.O-2); U3 5(N.C.); U4 4(NC)

### Library data of the parts
C19 C21 C23 = C0603-10µ: as C17 on sheet Mobile_device_sheet4_sensor; Part Number: C0603-10µ; Manufacturer: *; Manufacturer Part Number: *; LatestRevisionDate: 2011-01-17; Pin Count: 2; Publisher: Nordic Semiconductor; Published: 2011-01-17; Value: 10µF; Footprint Doc: 0603; ComponentLink1URL: *; ComponentLink1Description: Datasheet; ComponentLink2URL: *; ComponentLink2Description: Supplier link; HelpURL: *; Supplier 1: *; Supplier Part Number 1: *; Supplier 2: *; Supplier Part Number 2: *
C20 = C0402-100n: as C6 on sheet Mobile_device_sheet2_mcu; Part Number: C0402-100n; Manufacturer: *; Manufacturer Part Number: *; LatestRevisionDate: 2009-11-23; Pin Count: 2; Publisher: Nordic Semiconductor; Published: 2009-05-08; Value: 100nF; Footprint Doc: 0402; ComponentLink1URL: *; ComponentLink1Description: Datasheet; ComponentLink2URL: *; ComponentLink2Description: Supplier link; HelpURL: *; Supplier 1: *; Supplier Part Number 1: *; Supplier 2: *; Supplier Part Number 2: *
C22 = C0603-22µ-6.3V: as C47 on sheet Mobile_device_sheet4_sensor; Part Number: C0603-22µ-6.3V; Footprint Doc: 0603; LatestRevisionDate: 2015-04-10; Pin Count: 2; Publisher: Nordic Semiconductor; Published: 2015-04-10; Value: 22µF; Note: 6.3V; ComponentLink1URL: *; ComponentLink1Description: Datasheet; ComponentLink2URL: *; ComponentLink2Description: Supplier link; HelpURL: http://www.samsungsem.com/kr/front/downloadcms.do?path=/kr/support/product-search/mlcc/__icsFiles/afieldfile/2014/11/05&fileName=S_CL10A226MQ8NRNC.pdf; Supplier 1: Digi-Key; Supplier Part Number 1: 1276-1193-1-ND; Supplier 2: *; Supplier Part Number 2: *
C24 C25 = C0603-1µ0: as C1 on sheet Mobile_device_sheet2_mcu; Part Number: C0603-1µ0; Manufacturer: *; Manufacturer Part Number: *; Footprint Doc: 0603; LatestRevisionDate: 2013-06-05; Pin Count: 2; Publisher: Nordic Semiconductor; Published: 2009-05-08; Value: 1.0µF; ComponentLink1URL: *; ComponentLink1Description: Datasheet; ComponentLink2URL: *; ComponentLink2Description: Supplier link; HelpURL: *; Supplier 1: *; Supplier Part Number 1: *; Supplier 2: *; Supplier Part Number 2: *
J1 = USB-Micro-B-RA-SMD-PiP: MicroUSB-B-SMT; Manufacturer: Allen Creations Corp.; Manufacturer Part Number: AJU55-BS2111-L; Part number IPS: 00000007790; Artikkelnr Noca: 55029020; Part Number: USB-Micro-B-RA-SMD-PiP; Footprint Doc: USB-Micro-B-RA-SMD-PiP; LatestRevisionDate: 2016-04-21; Pin Count: 5; Publisher: Nordic Semiconductor; Published: 2014-10-07; Value: MicroUSB-B; Note: *; ComponentLink1URL: *; ComponentLink1Description: Datasheet; ComponentLink2URL: *; ComponentLink2Description: Supplier link; HelpURL: \\hizz\pro\app9717\Datasheet\connectores\Allen Creations Corp\AJU-211.pdf; Supplier 1: Cabcon; Supplier Part Number 1: AJU55-BS2111-L; Supplier 2: Digi-Key; Supplier Part Number 2: 609-4616-1-ND
J2 = SM03B-SRSS-TB: 1.0mm pitch connector side entry SMD; Manufacturer: JST; Manufacturer Part Number: SM03B-SRSS-TB(LF)(SN); Part number IPS: 00000001785; Note: JST, Header; Artikkelnr Noca: N.A.; Part Number: SM03B-SRSS-TB; Footprint Doc: SM03B-SRSS-TB; LatestRevisionDate: 2017-10-09; Pin Count: 3; Publisher: Nordic Semiconductor; Published: 2017-10-09; Value: HDR-3, 1mm; ComponentLink1URL: *; ComponentLink1Description: Datasheet; ComponentLink2URL: *; ComponentLink2Description: Supplier link; HelpURL: http://www.jst-mfg.com/product/pdf/eng/eSH.pdf; Supplier 1: Digi-Key; Supplier Part Number 1: 455-1803-1-ND; Supplier 2: *; Supplier Part Number 2: *
P1-P3 = Pin List 1x2, N.C.: Pin List 1x2, 2.54mm (100mil); Artikkelnr Noca: N.A.; Part Number: Pin List 1x2, N.C.; Manufacturer: *; Manufacturer Part Number: *; Footprint Doc: LIST_1x2; LatestRevisionDate: 2017-02-02; Pin Count: 2; Publisher: Nordic Semiconductor; Published: 2017-01-30; Value: Pin List 1x2; Note: *; Part number IPS: N.A.; ComponentLink1URL: *; ComponentLink1Description: Datasheet; ComponentLink2URL: *; ComponentLink2Description: Supplier link; HelpURL: *; Supplier 1: *; Supplier Part Number 1: *; Supplier 2: *; Supplier Part Number 2: *
Q1 = DMC2400UV: as Q4 on sheet Mobile_device_sheet4_sensor; Part Number: DMC2400UV; Manufacturer Part Number: DMC2400UV; Footprint Doc: SOT-563; LatestRevisionDate: 2016-01-18; Pin Count: 6; Publisher: Nordic Semiconductor; Published: 2016-01-18; Value: DMC2400UV; Supplier 1: Digi-Key; Supplier Part Number 1: DMC2400UV-7DICT-ND; Supplier 2: *; Supplier Part Number 2: *; ComponentLink1URL: *; ComponentLink1Description: Datasheet; ComponentLink2URL: *; ComponentLink2Description: Supplier link; HelpURL: http://www.diodes.com/_files/datasheets/DMC2400UV.pdf
R1 R3 = R0402-1M0: Resistor, ±1%, 0.063W; Part number IPS: 00000006807; Note: Chip Res 1%; Artikkelnr Noca: 27049145; Part Number: R0402-1M0; Manufacturer: *; Manufacturer Part Number: *; LatestRevisionDate: 2009-11-23; Pin Count: 2; Publisher: Nordic Semiconductor; Published: 2009-05-08; Value: 1M0; Footprint Doc: 0402; ComponentLink1URL: *; ComponentLink1Description: Datasheet; ComponentLink2URL: *; ComponentLink2Description: Supplier link; HelpURL: *; Supplier 1: *; Supplier Part Number 1: *; Supplier 2: *; Supplier Part Number 2: *
R2 R7 = R0402-10k: Resistor, ±1%, 0.063W; Part number IPS: 00000002093; Note: Chip Res 1%; Artikkelnr Noca: 27049097; Part Number: R0402-10k; Manufacturer: *; Manufacturer Part Number: *; LatestRevisionDate: 2009-11-23; Pin Count: 2; Publisher: Nordic Semiconductor; Published: 2009-05-08; Value: 10k; Footprint Doc: 0402; ComponentLink1URL: *; ComponentLink1Description: Datasheet; ComponentLink2URL: *; ComponentLink2Description: Supplier link; HelpURL: *; Supplier 1: Farnell; Supplier Part Number 1: 173-8864; Supplier 2: *; Supplier Part Number 2: *
R4 R8 = R0402-18k: Resistor, ±1%, 0.063W; Part number IPS: 00000003300; Note: Chip Res 1%; Artikkelnr Noca: 27049103; Part Number: R0402-18k; Manufacturer: *; Manufacturer Part Number: *; LatestRevisionDate: 2009-11-23; Pin Count: 2; Publisher: Nordic Semiconductor; Published: 2009-05-08; Value: 18k; Footprint Doc: 0402; ComponentLink1URL: *; ComponentLink1Description: Datasheet; ComponentLink2URL: *; ComponentLink2Description: Supplier link; HelpURL: *; Supplier 1: Farnell; Supplier Part Number 1: 173-8867; Supplier 2: *; Supplier Part Number 2: *
R5 = R0402-1M5: Resistor, ±1%, 0.063W; Part number IPS: 00000007809; Note: Chip Res 1%; Artikkelnr Noca: 27049149; Part Number: R0402-1M5; Manufacturer: *; Manufacturer Part Number: *; LatestRevisionDate: 2009-11-23; Pin Count: 2; Publisher: Nordic Semiconductor; Published: 2009-05-08; Value: 1M5; Footprint Doc: 0402; ComponentLink1URL: *; ComponentLink1Description: Datasheet; ComponentLink2URL: *; ComponentLink2Description: Supplier link; HelpURL: *; Supplier 1: *; Supplier Part Number 1: *; Supplier 2: *; Supplier Part Number 2: *
R6 = R0402-180k: Resistor, ±1%, 0.063W; Part number IPS: 00000007810; Note: Chip Res 1%; Artikkelnr Noca: 27049127; Part Number: R0402-180k; Manufacturer: *; Manufacturer Part Number: *; LatestRevisionDate: 2009-11-23; Pin Count: 2; Publisher: Nordic Semiconductor; Published: 2009-05-08; Value: 180k; Footprint Doc: 0402; ComponentLink1URL: *; ComponentLink1Description: Datasheet; ComponentLink2URL: *; ComponentLink2Description: Supplier link; HelpURL: *; Supplier 1: *; Supplier Part Number 1: *; Supplier 2: *; Supplier Part Number 2: *
R9 = R0402-27k: Resistor, ±1%, 0.063W; Part number IPS: 00000004188; Note: Chip Res 1%; Artikkelnr Noca: 27049107; Part Number: R0402-27k; Manufacturer: *; Manufacturer Part Number: *; LatestRevisionDate: 2009-11-23; Pin Count: 2; Publisher: Nordic Semiconductor; Published: 2009-05-08; Value: 27k; Footprint Doc: 0402; ComponentLink1URL: *; ComponentLink1Description: Datasheet; ComponentLink2URL: *; ComponentLink2Description: Supplier link; HelpURL: *; Supplier 1: Farnell; Supplier Part Number 1: 173-8869; Supplier 2: *; Supplier Part Number 2: *
R10 = R0402-15k: Resistor, ±1%, 0.063W; Part number IPS: 00000002098; Note: Chip Res 1%; Artikkelnr Noca: 27049101; Part Number: R0402-15k; Manufacturer: *; Manufacturer Part Number: *; LatestRevisionDate: 2009-11-23; Pin Count: 2; Publisher: Nordic Semiconductor; Published: 2009-05-08; Value: 15k; Footprint Doc: 0402; ComponentLink1URL: *; ComponentLink1Description: Datasheet; ComponentLink2URL: *; ComponentLink2Description: Supplier link; HelpURL: *; Supplier 1: Farnell; Supplier Part Number 1: 173-8866; Supplier 2: *; Supplier Part Number 2: *
R11 = NCP15XH103F03RC: THERMISTOR 10K OHM NTC 0402 SMD; Manufacturer: Murata; Part number IPS: 00000007808; Note: Chip Res 1%; Artikkelnr Noca: N.A.; Part Number: NCP15XH103F03RC; Manufacturer Part Number: NCP15XH103F03RC; LatestRevisionDate: 2015-03-25; Pin Count: 2; Publisher: Nordic Semiconductor; Published: 2015-03-25; Value: 10k; Footprint Doc: 0402; ComponentLink1URL: *; ComponentLink1Description: Datasheet; ComponentLink2URL: *; ComponentLink2Description: Supplier link; HelpURL: *; Supplier 1: Digi-Key; Supplier Part Number 1: 490-4801-1-ND; Supplier 2: Farnell; Supplier Part Number 2: 245-6121
SB1 = Solderbridge Shorted: as SB2 on sheet Mobile_device_sheet3_pin_map; Part Number: Solderbridge Shorted; Manufacturer: *; Manufacturer Part Number: *; Footprint Doc: Solderbridge_Shorted; LatestRevisionDate: 2012-08-07; Pin Count: 2; Publisher: Nordic Semiconductor; Published: 2012-08-07; Value: Solderbridge; Note: *; Part number IPS: N.A.; ComponentLink1URL: *; ComponentLink1Description: Datasheet; ComponentLink2URL: *; ComponentLink2Description: Supplier link; HelpURL: *; Supplier 1: *; Supplier Part Number 1: *; Supplier 2: *; Supplier Part Number 2: *
SW1 = Switch-Slide-RA-J-Lead-DPDT-8.5x3.5mm_C&K: SMD slide Switch (ON-ON); Manufacturer: C&K Components; Manufacturer Part Number: JS202011JAQN; Part number IPS: 00000007811; Artikkelnr Noca: N.A.; Part Number: Switch-Slide-RA-J-Lead-DPDT-8.5x3.5mm_C&K; Footprint Doc: Switch-Slide-RA-J-Lead-DPDT-8.5x3.5mm; LatestRevisionDate: 2017-02-01; Pin Count: 6; Publisher: Nordic Semiconductor; Published: 2016-09-15; Value: Switch; Note: *; ComponentLink1URL: *; ComponentLink1Description: Datasheet; ComponentLink2URL: *; ComponentLink2Description: Supplier link; HelpURL: http://www.ck-components.com/media/1422/js.pdf; Supplier 1: Digi-Key; Supplier Part Number 1: CKN10722CT-ND; Supplier 2: Mouser; Supplier Part Number 2: 611-JS202011JAQN
TP1-TP8 = TP_SMD_Ø1.5MM: as TP17 on sheet Mobile_device_sheet3_pin_map; Part Number: TP_SMD_Ø1.5MM; Manufacturer Part Number: *; Footprint Doc: TP_SMD_Ø1.5mm; LatestRevisionDate: 2016-06-02; Pin Count: 1; Publisher: Nordic Semiconductor; Published: 2016-06-02; Value: Ø1.5mm,SMD; Note: *; Part number IPS: N.A.; ComponentLink1URL: *; ComponentLink1Description: Datasheet; ComponentLink2URL: *; ComponentLink2Description: Supplier link; HelpURL: *; Supplier 1: *; Supplier Part Number 1: *; Supplier 2: *; Supplier Part Number 2: *
TP9 = Testpoint TH: Testpoint, through hole; Artikkelnr Noca: N.A.; Part Number: Testpoint TH; Manufacturer: *; Manufacturer Part Number: *; Footprint Doc: TESTPAD-TH; LatestRevisionDate: 2009-12-12; Pin Count: 1; Publisher: Nordic Semiconductor; Published: 2009-12-12; Value: TP; Note: *; Part number IPS: N.A.; ComponentLink1URL: *; ComponentLink1Description: Datasheet; ComponentLink2URL: *; ComponentLink2Description: Supplier link; HelpURL: *; Supplier 1: *; Supplier Part Number 1: *; Supplier 2: *; Supplier Part Number 2: *
U3 = XCL210C33: 3.3V 200mA Inductor Built-in Step-Down “micro DC/DC” Converter; Manufacturer: Torex Semiconductor; Part number IPS: 00000007826; Artikkelnr Noca: N.A.; Part Number: XCL210C33; Manufacturer Part Number: XCL210C33; Footprint Doc: CL-2025; LatestRevisionDate: 2017-01-30; Pin Count: 8; Publisher: Nordic Semiconductor; Published: 2016-09-29; Value: XCL210C33; Note: *; ComponentLink1URL: *; ComponentLink1Description: Datasheet; ComponentLink2URL: *; ComponentLink2Description: Supplier link; HelpURL: https://www.torexsemi.com/file/xcl210/XCL210.pdf; Supplier 1: *; Supplier Part Number 1: *; Supplier 2: *; Supplier Part Number 2: *
U4 = TCK106AF,LF: as U13 on sheet Mobile_device_sheet4_sensor; Part Number: TCK106AF,LF; Manufacturer Part Number: TCK106AF,LF; Footprint Doc: SOT-25; LatestRevisionDate: 2016-09-29; Pin Count: 5; Publisher: Nordic Semiconductor; Published: 2016-09-29; Value: TCK106AF; Note: *; Supplier 1: Digi-Key; Supplier Part Number 1: TCK106AFLFCT-ND; Supplier 2: *; Supplier Part Number 2: *; ComponentLink1URL: *; ComponentLink1Description: Datasheet; ComponentLink2URL: *; ComponentLink2Description: Supplier link; HelpURL: https://toshiba.semicon-storage.com/info/docget.jsp?did=53240&prodName=TCK108AF
U5 = XC6804A4E14R-G: One Cell Li-ion/Li-polymer Linear Charger IC with Battery Temperature Detection; Manufacturer: Torex Semiconductor; Part number IPS: 00000007825; Artikkelnr Noca: N.A.; Part Number: XC6804A4E14R-G; Manufacturer Part Number: XC6804A4E14R-G; Footprint Doc: USP-6EL; LatestRevisionDate: 2016-09-29; Pin Count: 6; Publisher: Nordic Semiconductor; Published: 2016-09-29; Value: XC6804A4E1; Note: *; ComponentLink1URL: *; ComponentLink1Description: Datasheet; ComponentLink2URL: *; ComponentLink2Description: Supplier link; HelpURL: https://www.torexsemi.com/file/xc6804/XC6804.pdf; Supplier 1: Digi-Key; Supplier Part Number 1: 893-1312-1-ND; Supplier 2: Mouser; Supplier Part Number 2: 865-XC6804A4E14R-G